# Altium schematic sheet devices.SchDoc
size A3
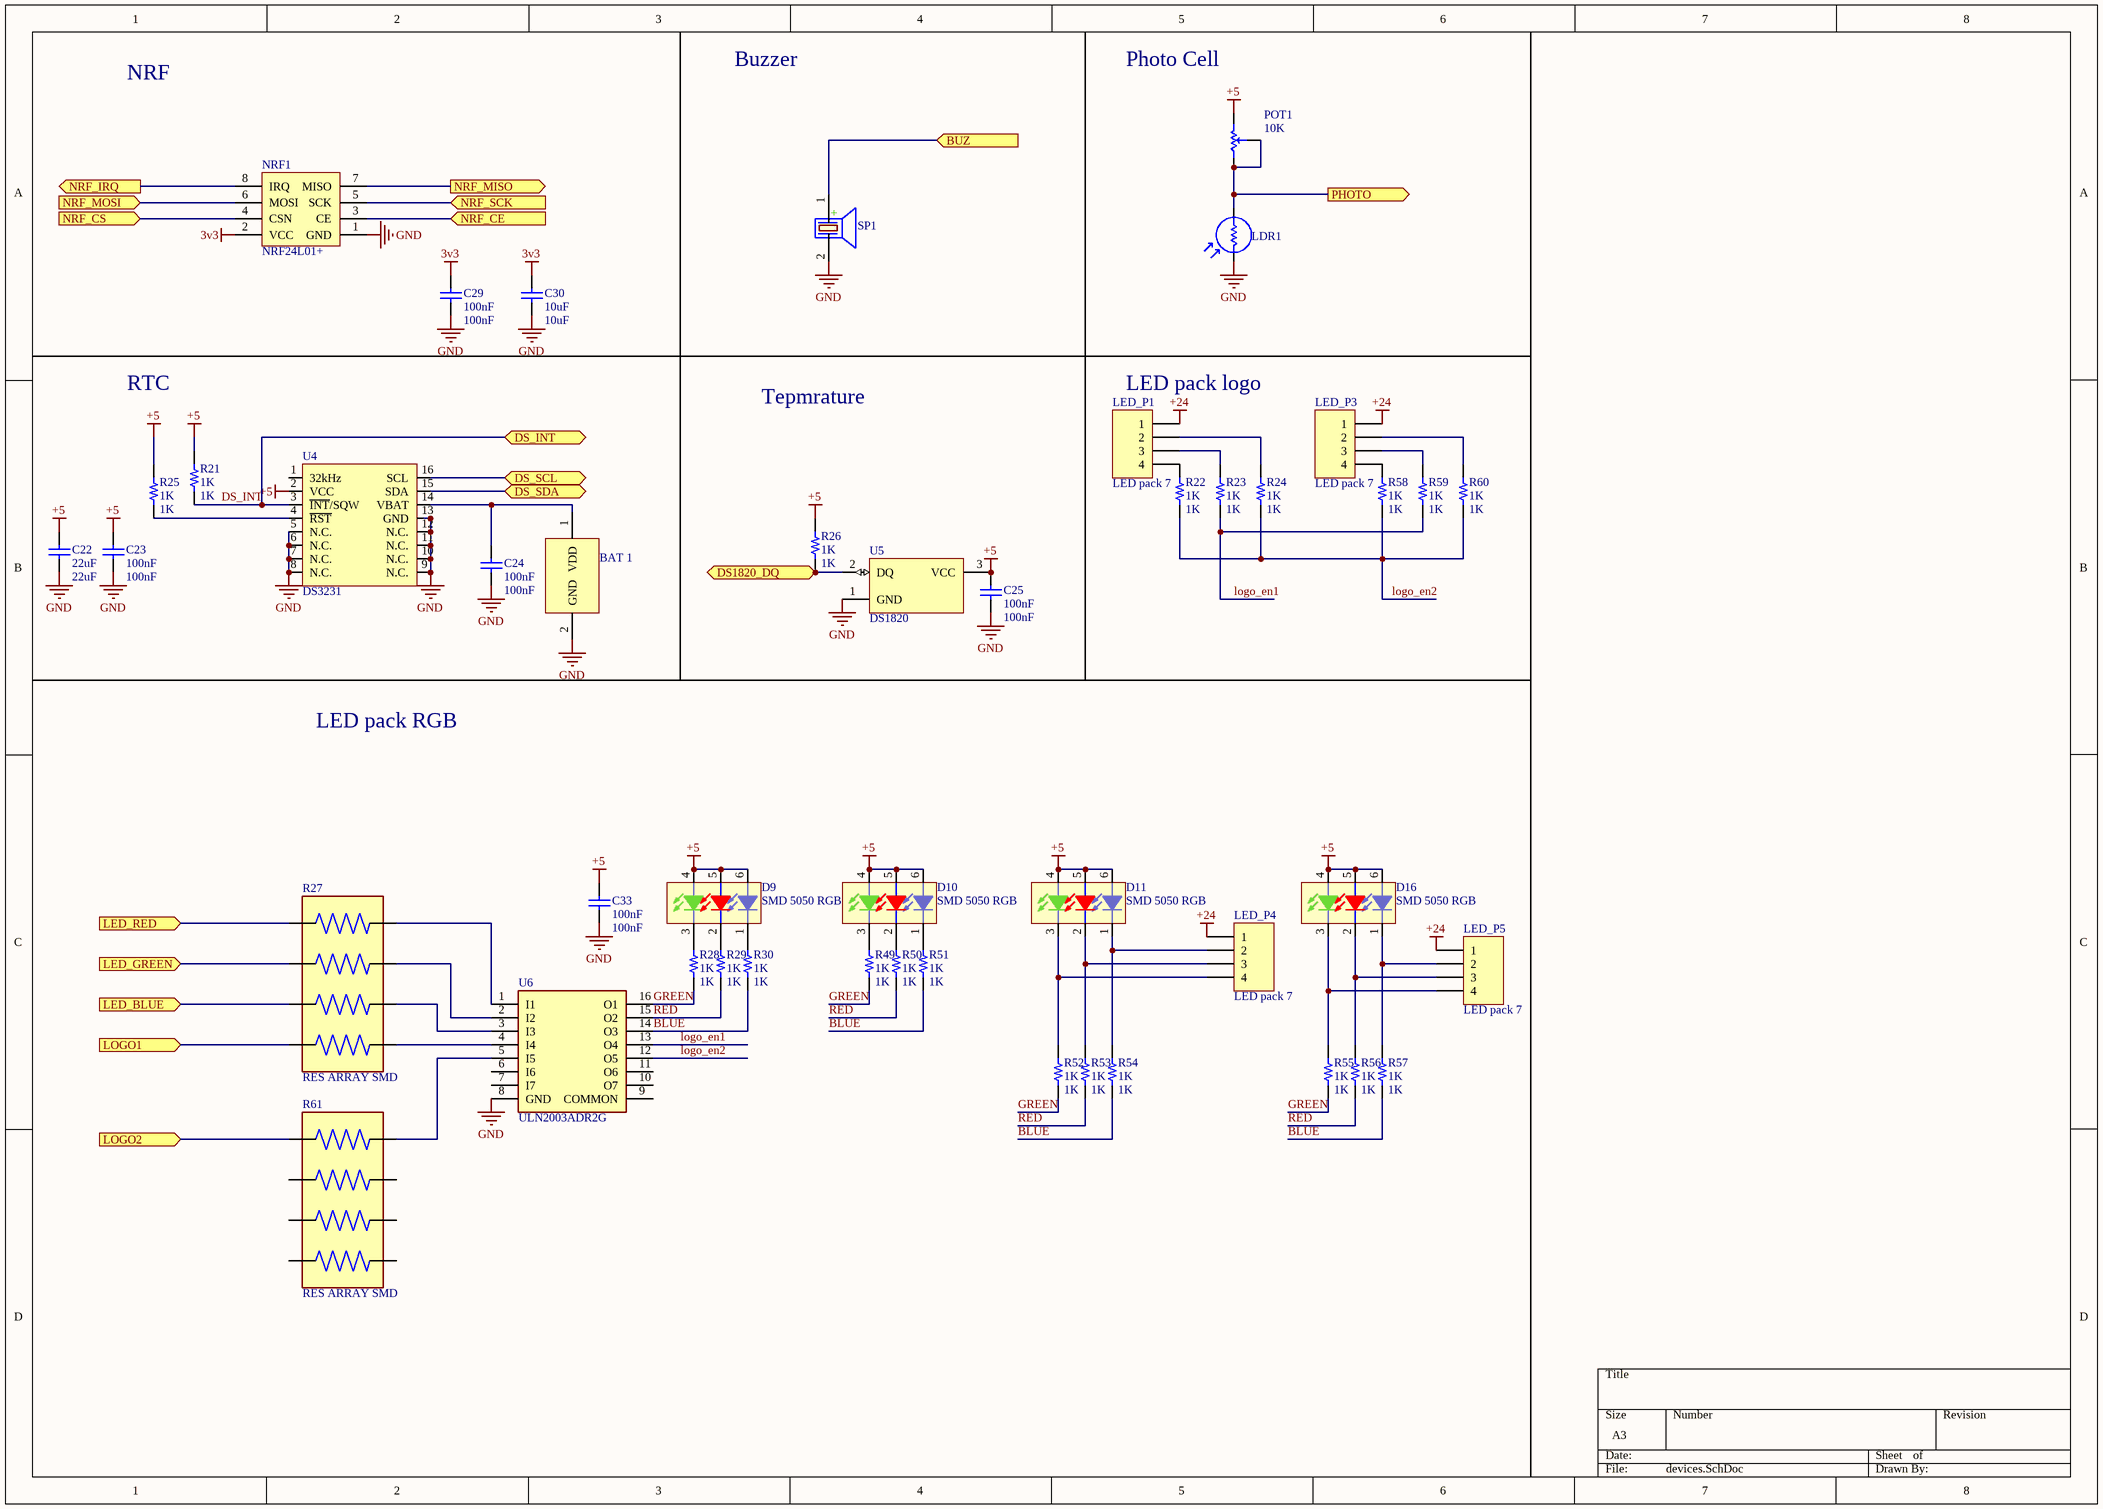
[diagram p0: devices.SchDoc]

## Parts
BAT_1  BAT Backup  [BATTERY_coin]  (value not drawn)
C22  22uF  [0603C]
C23  100nF  [0603C]
C24  100nF  [0603C]
C25  100nF  [0603C]
C29  100nF  [0603C]
C30  10uF  [0603C]
C33  100nF  [0603C]
D9  Comment_1: SMD 5050 RGB  [5050 LED package]  (hidden comment: 5050RGB)
D10  Comment_1: SMD 5050 RGB  [5050 LED package]  (hidden comment: 5050RGB)
D11  Comment_1: SMD 5050 RGB  [5050 LED package]  (hidden comment: 5050RGB)
D16  Comment_1: SMD 5050 RGB  [5050 LED package]  (hidden comment: 5050RGB)
LDR1  PhotoCell-5mm  [PhotoCell]  (value not drawn)
LED_P1  LED pack 7  [LED_PAKC_7]
LED_P3  LED pack 7  [LED_PAKC_7]
LED_P4  LED pack 7  [LED_PAKC_7]
LED_P5  LED pack 7  [LED_PAKC_7]
NRF1  NRF24L01+  [NRF24L01P]
POT1  10K  [POT 2]
R21  1K  [0603R]
R22  1K  [RES1812]
R23  1K  [RES1812]
R24  1K  [RES1812]
R25  1K  [0603R]
R26  1K  [0603R]
R27  RES ARRAY SMD  [RESCAXE80P320X160X70-8N]
R28  1K  [0603R]
R29  1K  [0603R]
R30  1K  [0603R]
R49  1K  [0603R]
R50  1K  [0603R]
R51  1K  [0603R]
R52  1K  [RES1812]
R53  1K  [RES1812]
R54  1K  [RES1812]
R55  1K  [RES1812]
R56  1K  [RES1812]
R57  1K  [RES1812]
R58  1K  [RES1812]
R59  1K  [RES1812]
R60  1K  [RES1812]
R61  RES ARRAY SMD  [RESCAXE80P320X160X70-8N]
SP1  BUZZER  [BUZZER 7.62mm DC]  (value not drawn)
U4  DS3231  [SO-16W]
U5  DS1820  [DS1820]
U6  ULN2003ADR2G  [SOIC127P600X175-16N]

## Ports
BUZ (in), DS1820_DQ (bidir), DS_INT (bidir), DS_SCL (bidir), DS_SDA (bidir), LED_BLUE (in), LED_GREEN (in), LED_RED (in), LOGO1 (in), LOGO2 (in), NRF_CE (in), NRF_CS (in), NRF_IRQ (out), NRF_MISO (out), NRF_MOSI (in), NRF_SCK (in), PHOTO (out)

## Nets
3v3: C29.2 C30.2 NRF1.2(VCC)
+5: C22.2 C23.2 C25.2 C33.2 D9.4 D9.5 D9.6 D10.4 D10.5 D10.6 D11.4 D11.5 D11.6 D16.4 D16.5 D16.6 POT1.2(CW) R21.2 R25.2 R26.2 U4.2(VCC) U5.3(VCC)
+24: LED_P1.1 LED_P3.1 LED_P4.1 LED_P5.1
GND: BAT_1.2(GND) C22.1 C23.1 C24.1 C25.1 C29.1 C30.1 C33.1 LDR1.1 NRF1.1(GND) SP1.2(-) U4.5(N.C.) U4.6(N.C.) U4.7(N.C.) U4.8(N.C.) U4.9(N.C.) U4.10(N.C.) U4.11(N.C.) U4.12(N.C.) U4.13(GND) U5.1(GND) U6.8(GND)
BLUE: R30.1 R51.1 R54.1 R57.1 U6.14(O3)
BUZ: SP1.1(+) ; port BUZ
DS1820_DQ: R26.1 U5.2(DQ) ; port DS1820_DQ
DS_INT: R21.1 U4.3(~{INT}/SQW) ; port DS_INT
DS_SCL: U4.16(SCL) ; port DS_SCL
DS_SDA: U4.15(SDA) ; port DS_SDA
GREEN: R28.1 R49.1 R52.1 R55.1 U6.16(O1)
LED_BLUE: R27.3 ; port LED_BLUE
LED_GREEN: R27.2 ; port LED_GREEN
LED_RED: R27.1 ; port LED_RED
LOGO1: R27.4 ; port LOGO1
LOGO2: R61.1 ; port LOGO2
logo_en1: R23.1 R59.1 U6.13(O4)
logo_en2: R22.2 R24.1 R58.2 R60.1 U6.12(O5)
NRF_CE: NRF1.3(CE) ; port NRF_CE
NRF_CS: NRF1.4(CSN) ; port NRF_CS
NRF_IRQ: NRF1.8(IRQ) ; port NRF_IRQ
NRF_MISO: NRF1.7(MISO) ; port NRF_MISO
NRF_MOSI: NRF1.6(MOSI) ; port NRF_MOSI
NRF_SCK: NRF1.5(SCK) ; port NRF_SCK
PHOTO: LDR1.2 POT1.1(CCW) POT1.3(SetPoint) ; port PHOTO
RED: R29.1 R50.1 R53.1 R56.1 U6.15(O2)
NetBAT_1_1: BAT_1.1(VDD) C24.2 U4.14(VBAT)
NetD9_1: D9.1 R30.2
NetD9_2: D9.2 R29.2
NetD9_3: D9.3 R28.2
NetD10_1: D10.1 R51.2
NetD10_2: D10.2 R50.2
NetD10_3: D10.3 R49.2
NetD11_1: D11.1 LED_P4.2 R54.2
NetD11_2: D11.2 LED_P4.3 R53.2
NetD11_3: D11.3 LED_P4.4 R52.2
NetD16_1: D16.1 LED_P5.2 R57.2
NetD16_2: D16.2 LED_P5.3 R56.2
NetD16_3: D16.3 LED_P5.4 R55.2
NetLED_P1_2: LED_P1.2 R24.2
NetLED_P1_3: LED_P1.3 R23.2
NetLED_P1_4: LED_P1.4 R22.1
NetLED_P3_2: LED_P3.2 R60.2
NetLED_P3_3: LED_P3.3 R59.2
NetLED_P3_4: LED_P3.4 R58.1
NetR25_1: R25.1 U4.4(~{RST})
NetR27_5: R27.5 U6.4(I4)
NetR27_6: R27.6 U6.3(I3)
NetR27_7: R27.7 U6.2(I2)
NetR27_8: R27.8 U6.1(I1)
NetR61_8: R61.8 U6.5(I5)

Not connected (* = marked no-connect by the designer): R61 2 3 4 5 6 7; U4 1(32kHz); U6 6(I6) 7(I7) 9(COMMON) 10(O7) 11(O6)

## Notes on the sheet
- NRF
- Buzzer
- Photo Cell
- RTC
- Tepmrature
- (near LED_P1) LED pack logo
- LED pack RGB

## Library data of the parts
BAT_1 = BAT Backup: COIL CELL CR1220
C22-C25 C29 C30 C33 = Cap: CAP SMD 0603; Published: 8-Jun-2000; LatestRevisionDate: 17-Jul-2002; LatestRevisionNote: Re-released for DXP Platform.; PackageReference: RAD-0.3; Publisher: Altium Limited; PackageDescription: Radial Cap, Thru-Hole; 2 Leads; 0.3 in Pin Spacing
  C22: Value: 22uF
  C23-C25 C29 C33: Value: 100nF
  C30: Value: 10uF
D9-D11 D16 = LED SMD 5050 RGB: SMD 5050 RGB LED; Designer: Abbas Basereh; Design Date: 1395/11/10; ComponentLink1Description: SMD 5050 RGB; ComponentLink1URL: http://www.yuanlei-led.com; ComponentLink2Description: Reference; PackageDescription: SMD 5050 RGB; Publisher: Abbas Basereh; Mounting Technology: Surface Mount; HelpURL: probably color of the leds not mached real please check and change; Pin Count: 6; Status: Unreleased
LDR1 = LDR: Photo Cell- Variable Resistor With Light; Company: IPA CO.; Designer: Saeid Jorablo; Last Update Time: 2008/07/17
LED_P1 LED_P3-LED_P5 = Header 4: 7led-red white LED pack; LatestRevisionDate: 17-Jul-2002; LatestRevisionNote: Re-released for DXP Platform.; Publisher: Altium Limited
NRF1 = NRF24L01P: NRF Module; Ali Hafizi: Creature
POT1 = POT: Variable Resistor; Value: 10K
R21 R25 R26 R28-R30 R49-R51 = Resistor: RES SMD 0603; Part Number: RCS0805100KFKEA; Value: 1K
R22-R24 R52-R60 = Resistor: RES SMD 1812; Part Number: RCS0805100KFKEA; Value: 1K
R27 R61 = YC164-JR-07330RL: RES Array 0603-4x 100 to 200 OHM; MF: Yageo; SnapEDA_Link: https://www.snapeda.com/parts/YC164-JR-07330RL/Yageo/view-part/106017/?ref=snap; Price: None; Mouser-Purchase-URL: https://snapeda.com/shop?store=Mouser&id=106017; DigiKey-Purchase-URL: https://snapeda.com/shop?store=DigiKey&id=106017; Value: *; MP: YC164-JR-07330RL; Package: 1206 Yageo; Availability: Unavailable
SP1 = PIEZO BUZZER: PIEZO BUZZER 5VOLTS; Designer: Abbas Basereh; Comment_1: SPEAKER AND BEEP; Design Date: 1395/11/14; ComponentLink2Description: Reference; PackageDescription: THD; Publisher: Abbas Basereh; Mounting Technology: THD; Pin Count: 2; Status: Unreleased
U4 = DS3231: DS3231 RTC
U5 = DS1820: 1-Wire Digital Thermometer; ComponentAvailability: Obsolete; Published: 13-Oct-2000; LatestRevisionDate: 17-Jul-2002; LatestRevisionNote: Re-released for DXP Platform.; DatasheetVersion: 5-Mar-1998; PackageVersion: 1999; PackageReference: PR35; Publisher: Altium Limited; PackageDescription: TO, Flat Index; 3 In-Line, Axial Leads; Body Dia. 4.6mm; Leads 0.56 x 0.51 mm (max); ComponentLink1Description: Manufacturer Link; ComponentLink1URL: http://www.maxim-ic.com/; ComponentLink2Description: Datasheet; ComponentLink2URL: http://pdfserv.maxim-ic.com/en/ds/DS1820-DS1820S.pdf; ComponentLink3Description: Discontinuation Notice; ComponentLink3URL: http://www.maxim-ic.com/qa/pdfs/non-obsolescence-letter.pdf
U6 = ULN2003ADR2G: ULN2003 SMD; Manufacturer_Name: ON Semiconductor; Datasheet Link: http://www.onsemi.com/pub/Collateral/ULN2003A-D.PDF; Height: 1.75mm; Manufacturer_Part_Number: ULN2003ADR2G; Mouser Part Number: 863-ULN2003ADR2G; Mouser Price/Stock: https://www.mouser.co.uk/ProductDetail/onsemi/ULN2003ADR2G?qs=t2BMfLoP1KRgd83C6tnDAg%3D%3D; Arrow Part Number: ULN2003ADR2G; Arrow Price/Stock: https://www.arrow.com/en/products/uln2003adr2g/on-semiconductor?region=europe